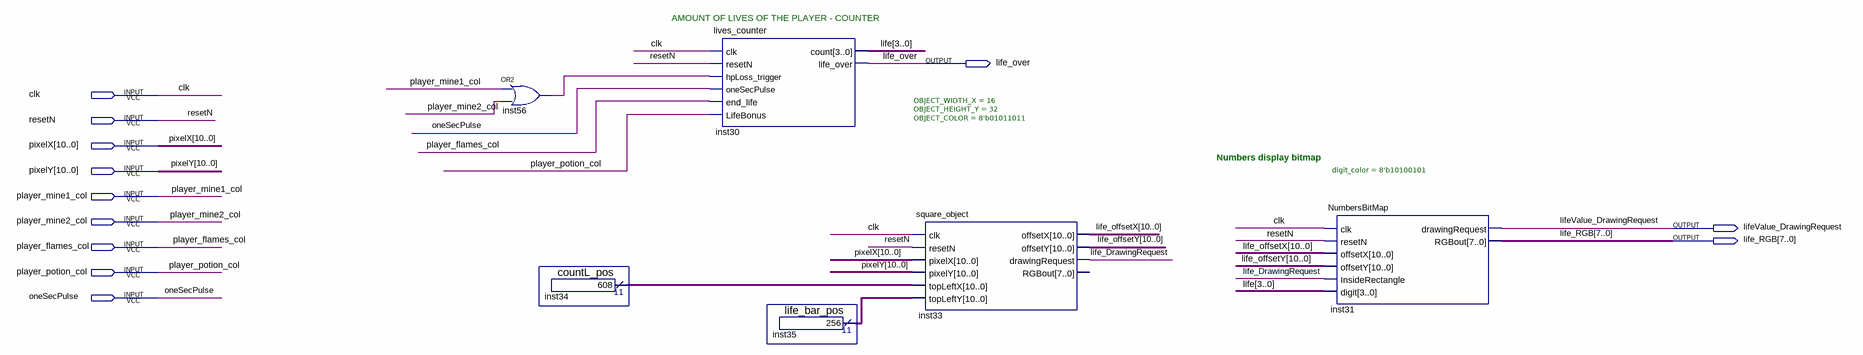
[diagram p0: schematic sheet]
// Quartus schematic LIVES_DISPLAY.bdf as structural Verilog: 6 symbols, 12 pins
module LIVES_DISPLAY (
  input  clk,
  input  resetN,
  input  [10:0] pixelX,
  input  [10:0] pixelY,
  input  player_mine1_col,
  input  player_mine2_col,
  input  player_flames_col,
  input  player_potion_col,
  input  oneSecPulse,
  output life_over,
  output lifeValue_DrawingRequest,
  output [7:0] life_RGB
);

  wire inst56_out, life_DrawingRequest;
  wire [3:0] life;
  wire [10:0] inst34_result, inst35_result, life_offsetX, life_offsetY;

  or inst56 (inst56_out, player_mine1_col, player_mine2_col);
  countL_pos inst34 (.result(inst34_result));
  lives_counter inst30 (
    .clk(clk), .resetN(resetN), .hpLoss_trigger(inst56_out), .oneSecPulse(oneSecPulse),
    .end_life(player_flames_col), .LifeBonus(player_potion_col), .count(life), .life_over(life_over));
  life_bar_pos inst35 (.result(inst35_result));
  square_object #(.OBJECT_WIDTH_X(16), .OBJECT_HEIGHT_Y(32), .OBJECT_COLOR(8'b01011011)) inst33 (
    .clk(clk), .resetN(resetN), .pixelX(pixelX), .pixelY(pixelY), .topLeftX(inst34_result),
    .topLeftY(inst35_result), .offsetX(life_offsetX), .offsetY(life_offsetY),
    .drawingRequest(life_DrawingRequest));  // open: RGBout
  NumbersBitMap #(.digit_color(8'b10100101)) inst31 (
    .clk(clk), .resetN(resetN), .offsetX(life_offsetX), .offsetY(life_offsetY),
    .InsideRectangle(life_DrawingRequest), .digit(life), .drawingRequest(lifeValue_DrawingRequest),
    .RGBout(life_RGB));

  // Notes on the sheet:
  //   AMOUNT OF LIVES OF THE PLAYER - COUNTER
  //   Numbers display bitmap
endmodule
